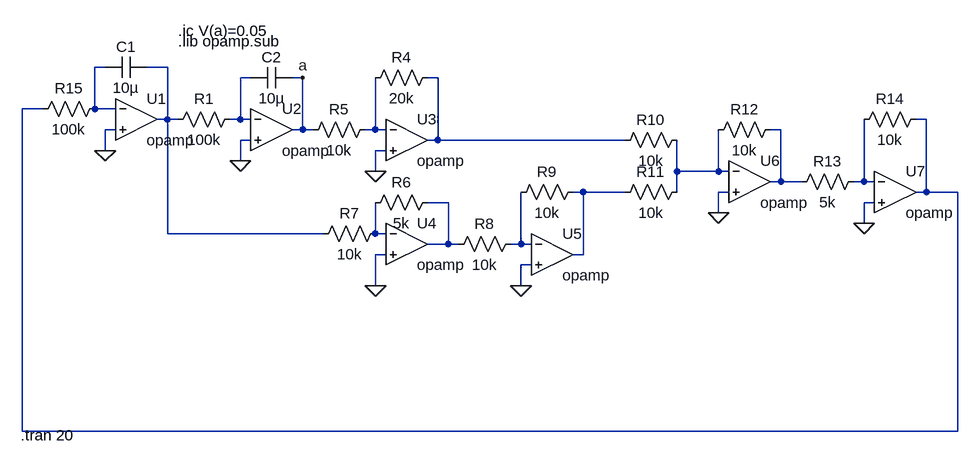
[diagram p0: schematic dhm.asc]
dhm.asc, the LTspice schematic file:
Version 4
SHEET 1 1444 680
WIRE 128 64 112 64
WIRE 224 64 192 64
WIRE 352 80 336 80
WIRE 432 80 416 80
WIRE 640 80 624 80
WIRE 32 128 0 128
WIRE 112 128 112 64
WIRE 144 128 112 128
WIRE 224 144 224 64
WIRE 224 144 208 144
WIRE 240 144 224 144
WIRE 336 144 336 80
WIRE 336 144 320 144
WIRE 352 144 336 144
WIRE 1392 144 1376 144
WIRE 144 160 128 160
WIRE 432 160 432 80
WIRE 432 160 416 160
WIRE 448 160 432 160
WIRE 544 160 544 80
WIRE 544 160 528 160
WIRE 560 160 544 160
WIRE 1168 160 1152 160
WIRE 352 176 336 176
WIRE 640 176 640 80
WIRE 640 176 624 176
WIRE 928 176 640 176
WIRE 128 192 128 160
WIRE 560 192 544 192
WIRE 336 208 336 176
WIRE 544 224 544 192
WIRE 1008 224 1008 176
WIRE 1072 224 1072 160
WIRE 1072 224 1008 224
WIRE 1088 224 1072 224
WIRE 1168 240 1168 160
WIRE 1168 240 1152 240
WIRE 1200 240 1168 240
WIRE 1296 240 1296 144
WIRE 1296 240 1280 240
WIRE 1312 240 1296 240
WIRE 864 256 848 256
WIRE 928 256 864 256
WIRE 1008 256 1008 224
WIRE 1088 256 1072 256
WIRE 1392 256 1392 144
WIRE 1392 256 1376 256
WIRE 1440 256 1392 256
WIRE 656 272 624 272
WIRE 1312 272 1296 272
WIRE 1072 288 1072 256
WIRE 1296 304 1296 272
WIRE 224 320 224 144
WIRE 464 320 224 320
WIRE 544 320 544 272
WIRE 560 320 544 320
WIRE 656 336 656 272
WIRE 656 336 624 336
WIRE 672 336 656 336
WIRE 768 336 768 256
WIRE 768 336 752 336
WIRE 784 336 768 336
WIRE 560 352 544 352
WIRE 864 352 864 256
WIRE 864 352 848 352
WIRE 784 368 768 368
WIRE 544 400 544 352
WIRE 768 400 768 368
WIRE 0 624 0 128
WIRE 1440 624 1440 256
WIRE 1440 624 0 624
FLAG 544 224 0
FLAG 336 208 0
FLAG 128 192 0
FLAG 544 400 0
FLAG 768 400 0
FLAG 1072 288 0
FLAG 1296 304 0
FLAG 432 80 a
SYMBOL OpAmps\\opamp 176 80 R0
SYMATTR InstName U1
SYMBOL OpAmps\\opamp 384 96 R0
SYMATTR InstName U2
SYMBOL res 336 128 R90
WINDOW 0 0 56 VBottom 2
WINDOW 3 32 56 VTop 2
SYMATTR InstName R1
SYMATTR Value 100k
SYMBOL cap 192 48 R90
WINDOW 0 0 32 VBottom 2
WINDOW 3 32 32 VTop 2
SYMATTR InstName C1
SYMATTR Value 10µ
SYMBOL cap 416 64 R90
WINDOW 0 0 32 VBottom 2
WINDOW 3 32 32 VTop 2
SYMATTR InstName C2
SYMATTR Value 10µ
SYMBOL OpAmps\\opamp 592 112 R0
SYMATTR InstName U3
SYMBOL OpAmps\\opamp 592 272 R0
SYMATTR InstName U4
SYMBOL res 640 64 R90
WINDOW 0 0 56 VBottom 2
WINDOW 3 32 56 VTop 2
SYMATTR InstName R4
SYMATTR Value 20k
SYMBOL res 544 144 R90
WINDOW 0 0 56 VBottom 2
WINDOW 3 32 56 VTop 2
SYMATTR InstName R5
SYMATTR Value 10k
SYMBOL res 640 256 R90
WINDOW 0 0 56 VBottom 2
WINDOW 3 32 56 VTop 2
SYMATTR InstName R6
SYMATTR Value 5k
SYMBOL res 560 304 R90
WINDOW 0 0 56 VBottom 2
WINDOW 3 32 56 VTop 2
SYMATTR InstName R7
SYMATTR Value 10k
SYMBOL OpAmps\\opamp 816 288 R0
SYMATTR InstName U5
SYMBOL res 768 320 R90
WINDOW 0 0 56 VBottom 2
WINDOW 3 32 56 VTop 2
SYMATTR InstName R8
SYMATTR Value 10k
SYMBOL res 864 240 R90
WINDOW 0 0 56 VBottom 2
WINDOW 3 32 56 VTop 2
SYMATTR InstName R9
SYMATTR Value 10k
SYMBOL OpAmps\\opamp 1120 176 R0
SYMATTR InstName U6
SYMBOL res 1024 160 R90
WINDOW 0 0 56 VBottom 2
WINDOW 3 32 56 VTop 2
SYMATTR InstName R10
SYMATTR Value 10k
SYMBOL res 1024 240 R90
WINDOW 0 0 56 VBottom 2
WINDOW 3 32 56 VTop 2
SYMATTR InstName R11
SYMATTR Value 10k
SYMBOL res 1168 144 R90
WINDOW 0 0 56 VBottom 2
WINDOW 3 32 56 VTop 2
SYMATTR InstName R12
SYMATTR Value 10k
SYMBOL OpAmps\\opamp 1344 192 R0
SYMATTR InstName U7
SYMBOL res 1296 224 R90
WINDOW 0 0 56 VBottom 2
WINDOW 3 32 56 VTop 2
SYMATTR InstName R13
SYMATTR Value 5k
SYMBOL res 1392 128 R90
WINDOW 0 0 56 VBottom 2
WINDOW 3 32 56 VTop 2
SYMATTR InstName R14
SYMATTR Value 10k
SYMBOL res 128 112 R90
WINDOW 0 0 56 VBottom 2
WINDOW 3 32 56 VTop 2
SYMATTR InstName R15
SYMATTR Value 100k
TEXT 240 24 Left 2 !.lib opamp.sub
TEXT -2 630 Left 2 !.tran 20
TEXT 240 8 Left 2 !.ic V(a)=0.05

The netlist it stands for:
* dhm.asc
XU1 N001 0 N002 opamp Aol=100K GBW=10Meg  ; pins invin noninvin out
XU2 N003 0 a opamp Aol=100K GBW=10Meg  ; pins invin noninvin out
R1 N003 N002 100k
C1 N002 N001 10µ
C2 a N003 10µ
XU3 N006 0 N004 opamp Aol=100K GBW=10Meg  ; pins invin noninvin out
XU4 N012 0 N011 opamp Aol=100K GBW=10Meg  ; pins invin noninvin out
R4 N004 N006 20k
R5 N006 a 10k
R6 N011 N012 5k
R7 N012 N002 10k
XU5 N013 0 N010 opamp Aol=100K GBW=10Meg  ; pins invin noninvin out
R8 N013 N011 10k
R9 N010 N013 10k
XU6 N008 0 N007 opamp Aol=100K GBW=10Meg  ; pins invin noninvin out
R10 N008 N004 10k
R11 N008 N010 10k
R12 N007 N008 10k
XU7 N009 0 N005 opamp Aol=100K GBW=10Meg  ; pins invin noninvin out
R13 N009 N007 5k
R14 N005 N009 10k
R15 N001 N005 100k
.lib opamp.sub
.tran 20
.ic V(a)=0.05
.backanno
.end